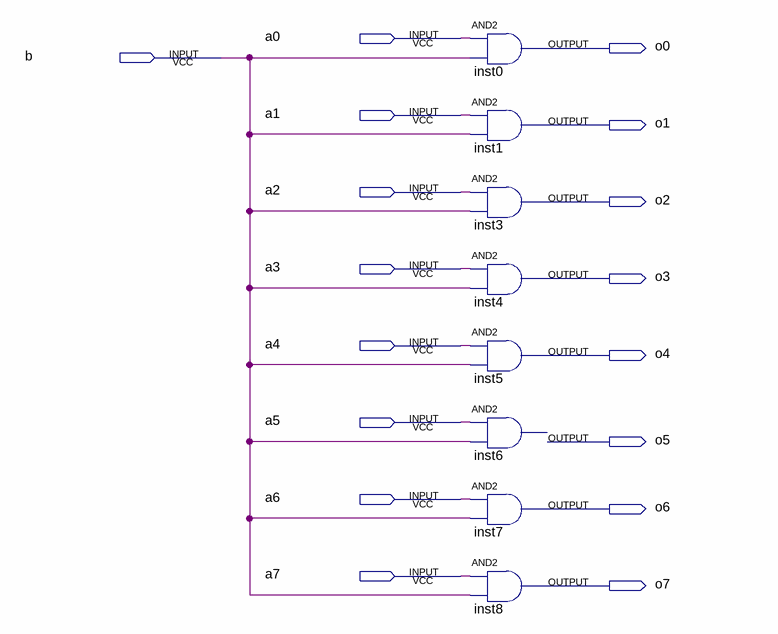
[diagram p0: schematic sheet]
// Quartus schematic 8x1multiplier.bdf as structural Verilog: 8 symbols, 17 pins
module \8x1multiplier  (
  input  a0,
  input  b,
  input  a1,
  input  a2,
  input  a3,
  input  a4,
  input  a5,
  input  a6,
  input  a7,
  output o0,
  output o1,
  output o2,
  output o3,
  output o4,
  output o5,
  output o6,
  output o7
);

  and inst0 (o0, a0, b);
  and inst1 (o1, a1, b);
  and inst3 (o2, a2, b);
  and inst4 (o3, a3, b);
  and inst5 (o4, a4, b);
  // AND2 inst6 has open pins: IN1=a5, IN2=b, OUT=open
  and inst7 (o6, a6, b);
  and inst8 (o7, a7, b);
endmodule
